# EAGLE design SARduino_644 (EAGLE 5.10)
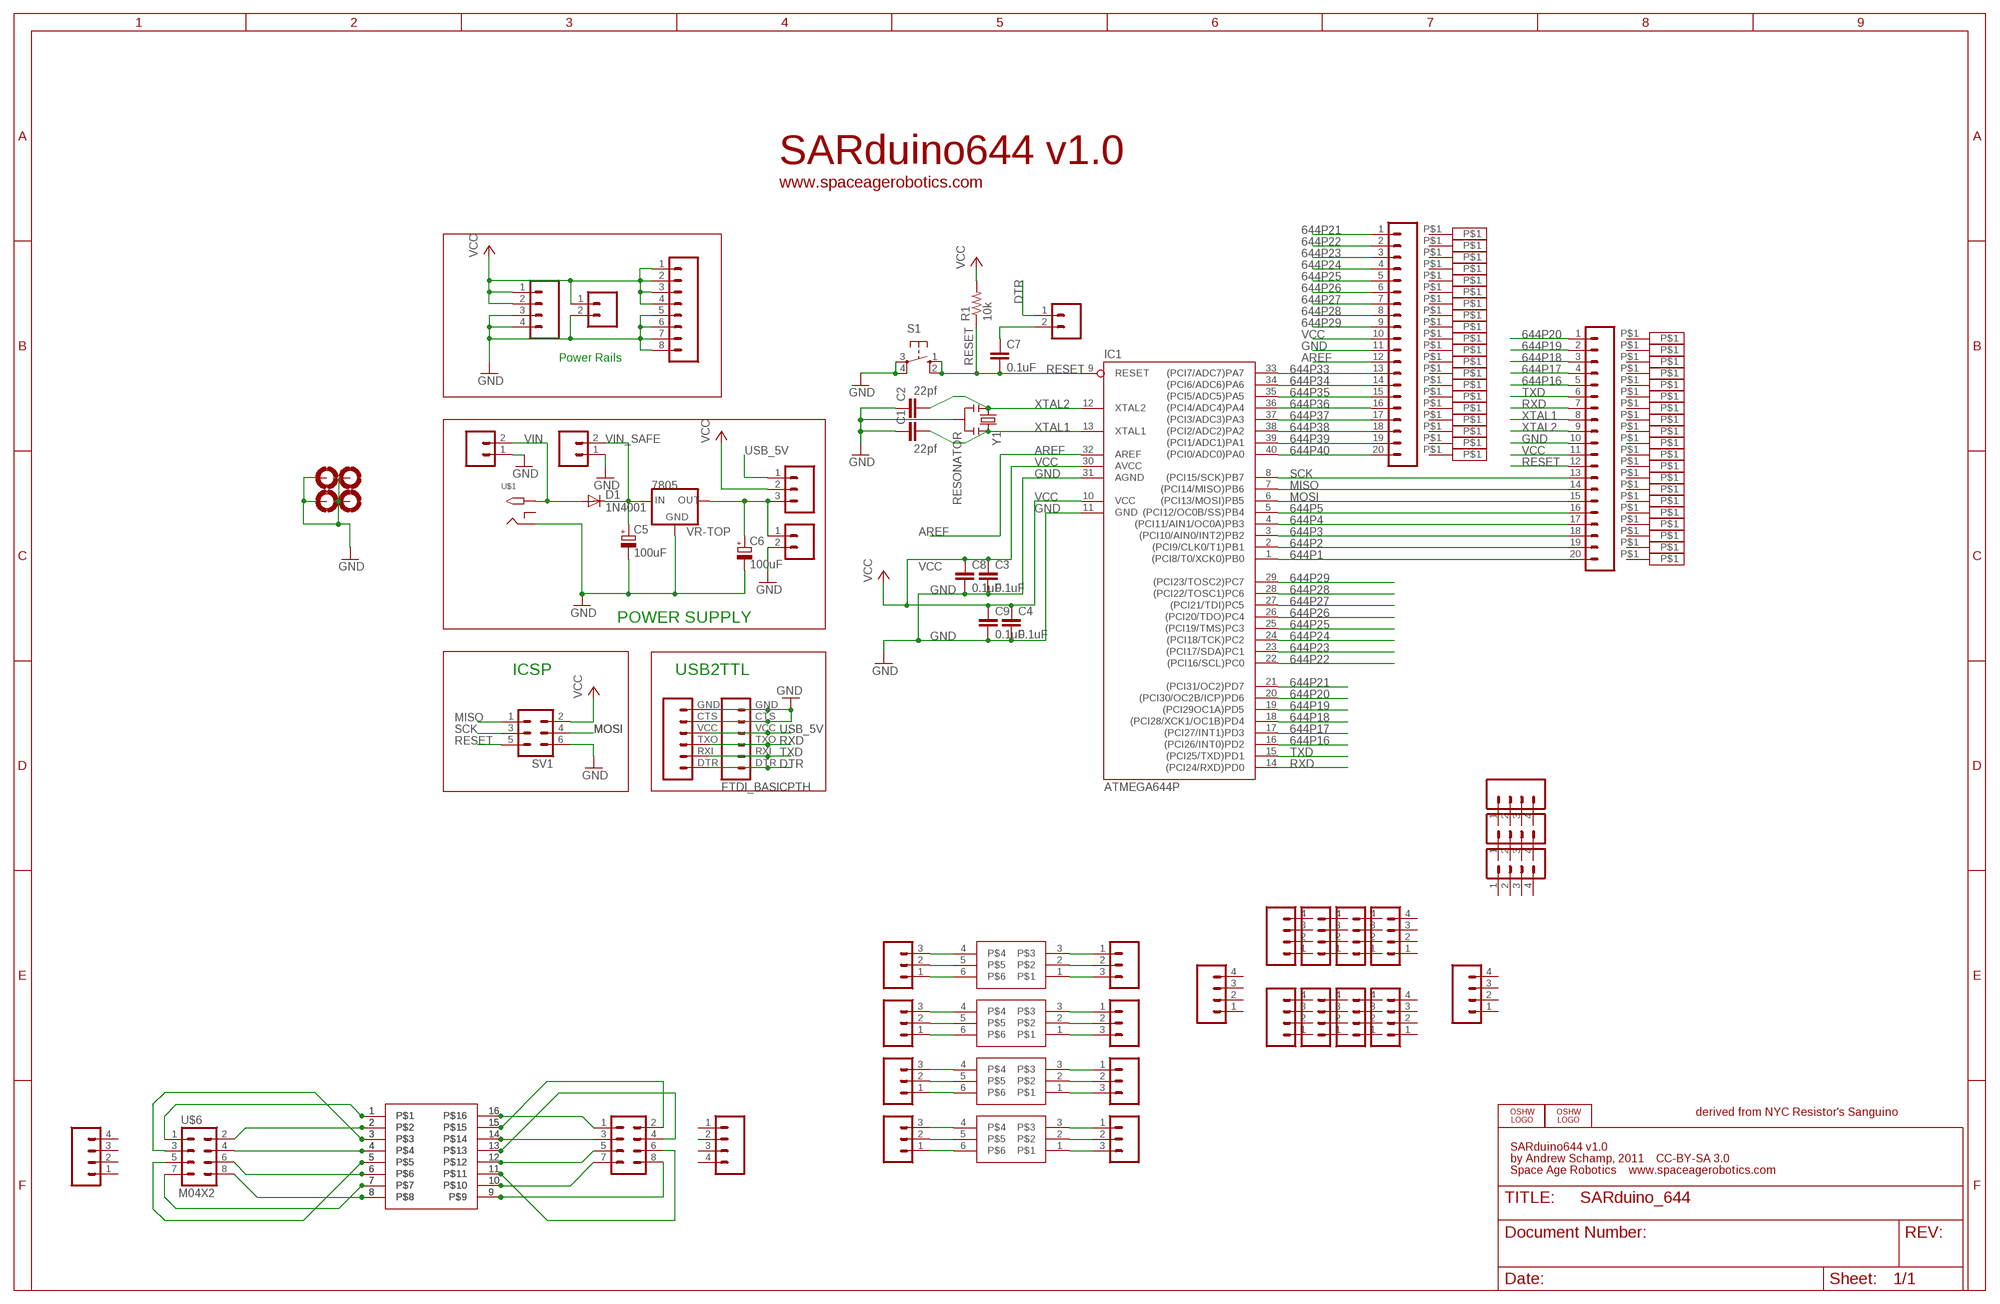
[diagram p0: schematic, sheet 1]

## Parts
C1  22pf  C-EU025-025X050  [C025-025X050]
C2  22pf  C-EU025-025X050  [C025-025X050]
C3  0.1uF  CAPPTH2  [CAP-PTH-SMALL2]
C4  0.1uF  CAPPTH2  [CAP-PTH-SMALL2]
C5  100uF  CPOL-EUE2.5-6  [E2,5-6]
C6  100uF  CPOL-EUE2.5-6  [E2,5-6]
C7  0.1uF  CAPPTH2  [CAP-PTH-SMALL2]
C8  0.1uF  CAP0805  [0805]
C9  0.1uF  CAP0805  [0805]
D1  1N4001  1N4004  [DO41-10]
IC1  ATMEGA644P  ATMEGA644V-10P  [DIL40]
JP1  M03PTH  [1X03]
JP2  M03PTH  [1X03]
JP3  MOUNT-PAD-ROUND2.8  [2,8-PAD]
JP4  MOUNT-PAD-ROUND2.8  [2,8-PAD]
JP5  M03PTH  [1X03]
JP6  M03PTH  [1X03]
JP7  MOUNT-PAD-ROUND2.8  [2,8-PAD]
JP8  M03PTH  [1X03]
JP9  MOUNT-PAD-ROUND2.8  [2,8-PAD]
JP10  FTDI_BASICPTH  [FTDI_BASIC_NO_LABEL]
JP11  M03PTH  [1X03]
JP12  M03PTH  [1X03]
JP13  M03PTH  [1X03]
JP14  M04PTH  [1X04]
JP15  M04PTH  [1X04]
JP16  M04PTH  [1X04]
JP17  M04PTH  [1X04]
JP18  M04PTH  [1X04]
JP19  M04PTH  [1X04]
JP20  M04PTH  [1X04]
JP21  M04PTH  [1X04]
JP22  M04PTH  [1X04]
JP23  M04PTH  [1X04]
JP24  M03PTH  [1X03]
JP25  FTDI_BASICPTH  [FTDI_BASIC_NO_LABEL]
JP26  M04PTH  [1X04]
JP27  M04PTH  [1X04]
JP28  M02PTH  [1X02]
JP29  M20  [1X20]
JP30  M20  [1X20]
JP31  M02PTH  [1X02]
JP32  M02PTH  [1X02]
JP33  M02PTH  [1X02]
JP34  M08  [1X08]
JP35  M04PTH  [1X04]
JP36  M02PTH  [1X02]
JP37  M04PTH  [1X04]
JP38  M04PTH  [1X04]
JP39  M04PTH  [1X04]
LOGO1  OSHW_LOGO_FILLX0350-NT  [OSHW_FILLX350_NOTEXT]
LOGO2  OSHW_LOGO_FILLX0350-NT  [OSHW_FILLX350_NOTEXT]
R1  10k  R-US_0207/2V  [0207/2V]
S1  10-XX  [B3F-10XX]
SV1  ML6  [ML6]
U$1  2.1MMJACKTHM  [PJ-102A]
U$2  3-PIN-STRIP  [1X03_STRIP]
U$3  16-PINSOICW  [SO16W]
U$4  16-PINSOIC  [SO16]
U$5  M04X2  [2X4]
U$6  M04X2  [2X4]
U$8  6-PINSC70-6  [SC70-6L]
U$9  3-PIN-STRIP  [1X03_STRIP]
U$10  3-PIN-STRIP  [1X03_STRIP]
U$11  3-PIN-STRIP  [1X03_STRIP]
U$12  3-PIN-STRIP  [1X03_STRIP]
U$13  3-PIN-STRIP  [1X03_STRIP]
U$14  3-PIN-STRIP  [1X03_STRIP]
U$15  3-PIN-STRIP  [1X03_STRIP]
U$16  3-PIN-STRIP  [1X03_STRIP]
U$17  3-PIN-STRIP  [1X03_STRIP]
U$18  3-PIN-STRIP  [1X03_STRIP]
U$19  3-PIN-STRIP  [1X03_STRIP]
U$20  3-PIN-STRIP  [1X03_STRIP]
U$21  3-PIN-STRIP  [1X03_STRIP]
U$22  3-PIN-STRIP  [1X03_STRIP]
U$23  3-PIN-STRIP  [1X03_STRIP]
U$24  3-PIN-STRIP  [1X03_STRIP]
U$25  3-PIN-STRIP  [1X03_STRIP]
U$26  3-PIN-STRIP  [1X03_STRIP]
U$27  3-PIN-STRIP  [1X03_STRIP]
U$28  3-PIN-STRIP  [1X03_STRIP]
U$29  3-PIN-STRIP  [1X03_STRIP]
U$30  3-PIN-STRIP  [1X03_STRIP]
U$31  3-PIN-STRIP  [1X03_STRIP]
U$32  3-PIN-STRIP  [1X03_STRIP]
U$33  3-PIN-STRIP  [1X03_STRIP]
U$34  3-PIN-STRIP  [1X03_STRIP]
U$35  3-PIN-STRIP  [1X03_STRIP]
U$36  3-PIN-STRIP  [1X03_STRIP]
U$37  3-PIN-STRIP  [1X03_STRIP]
U$38  3-PIN-STRIP  [1X03_STRIP]
U$39  3-PIN-STRIP  [1X03_STRIP]
U$40  3-PIN-STRIP  [1X03_STRIP]
U$41  3-PIN-STRIP  [1X03_STRIP]
U$42  3-PIN-STRIP  [1X03_STRIP]
U$43  3-PIN-STRIP  [1X03_STRIP]
U$44  3-PIN-STRIP  [1X03_STRIP]
U$45  3-PIN-STRIP  [1X03_STRIP]
U$46  3-PIN-STRIP  [1X03_STRIP]
U$47  3-PIN-STRIP  [1X03_STRIP]
U$48  6-PINSOT23-6  [SOT23-6L]
U$50  6-PINSC70-6  [SC70-6L]
U$53  6-PINSOT23-6  [SOT23-6L]
VR-TOP  7805  V_REG_78XXSINK  [TO220-IGO]
Y1  RESONATOR  [RESONATOR/CRYSTAL_COMBO]

## Nets
644P1: IC1.1((PCI8/T0/XCK0)PB0) JP30.20
644P2: IC1.2((PCI9/CLK0/T1)PB1) JP30.19
644P3: IC1.3((PCI10/AIN0/INT2)PB2) JP30.18
644P4: IC1.4((PCI11/AIN1/OC0A)PB3) JP30.17
644P5: IC1.5((PCI12/OC0B/SS)PB4) JP30.16
644P16: IC1.16((PCI26/INT0)PD2) JP30.5
644P17: IC1.17((PCI27/INT1)PD3) JP30.4
644P18: IC1.18((PCI28/XCK1/OC1B)PD4) JP30.3
644P19: IC1.19((PCI29OC1A)PD5) JP30.2
644P20: IC1.20((PCI30/OC2B/ICP)PD6) JP30.1
644P21: IC1.21((PCI31/OC2)PD7) JP29.1
644P22: IC1.22((PCI16/SCL)PC0) JP29.2
644P23: IC1.23((PCI17/SDA)PC1) JP29.3
644P24: IC1.24((PCI18/TCK)PC2) JP29.4
644P25: IC1.25((PCI19/TMS)PC3) JP29.5
644P26: IC1.26((PCI20/TDO)PC4) JP29.6
644P27: IC1.27((PCI21/TDI)PC5) JP29.7
644P28: IC1.28((PCI22/TOSC1)PC6) JP29.8
644P29: IC1.29((PCI23/TOSC2)PC7) JP29.9
644P33: IC1.33((PCI7/ADC7)PA7) JP29.13
644P34: IC1.34((PCI6/ADC6)PA6) JP29.14
644P35: IC1.35((PCI5/ADC5)PA5) JP29.15
644P36: IC1.36((PCI4/ADC4)PA4) JP29.16
644P37: IC1.37((PCI3/ADC3)PA3) JP29.17
644P38: IC1.38((PCI2/ADC2)PA2) JP29.18
644P39: IC1.39((PCI1/ADC1)PA1) JP29.19
644P40: IC1.40((PCI0/ADC0)PA0) JP29.20
AREF: IC1.32(AREF) JP29.12
DTR: JP10.DTR JP25.DTR JP28.1
GND: C1.1 C2.1 C3.2 C4.2 C5.- C6.- C8.2 C9.2 IC1.11(GND) IC1.31(AGND) JP3.B2,8(MOUNT) JP4.B2,8(MOUNT) JP7.B2,8(MOUNT) JP9.B2,8(MOUNT) JP10.CTS JP10.GND JP25.CTS JP25.GND JP29.11 JP30.10 JP31.1 JP32.1 JP33.2 JP34.5 JP34.6 JP34.7 JP34.8 JP35.3 JP35.4 JP36.2 S1.3(P) S1.4(P1) SV1.6 U$1.RING VR-TOP.GND Y1.2
MISO: IC1.7((PCI14/MISO)PB6) JP30.14 SV1.1
MOSI: IC1.6((PCI13/MOSI)PB5) JP30.15 SV1.4
N$1: JP1.3 U$8.4
N$2: JP1.2 U$8.5
N$3: JP1.1 U$8.6
N$4: JP2.3 U$48.4
N$5: JP2.2 U$48.5
N$6: JP2.1 U$48.6
N$7: JP5.1 U$48.3
N$8: JP5.2 U$48.2
N$9: JP5.3 U$48.1
N$10: JP8.1 U$8.3
N$11: U$3.16 U$4.16 U$5.1
N$12: U$3.15 U$4.15 U$5.2
N$13: JP8.2 U$8.2
N$14: U$3.5 U$4.5 U$6.5
N$15: U$3.1 U$4.1 U$6.1
N$16: JP8.3 U$8.1
N$17: JP11.3 U$50.4
N$18: JP11.2 U$50.5
N$19: JP11.1 U$50.6
N$20: JP12.1 U$50.3
N$21: U$3.14 U$4.14 U$5.3
N$22: U$3.13 U$4.13 U$5.4
N$23: U$3.12 U$4.12 U$5.5
N$24: U$3.11 U$4.11 U$5.6
N$25: U$3.10 U$4.10 U$5.7
N$26: U$3.9 U$4.9 U$5.8
N$27: U$3.8 U$4.8 U$6.8
N$28: U$3.7 U$4.7 U$6.7
N$29: U$3.6 U$4.6 U$6.6
N$30: JP12.2 U$50.2
N$31: U$3.4 U$4.4 U$6.4
N$33: U$3.2 U$4.2 U$6.2
N$34: JP12.3 U$50.1
N$35: JP13.3 U$53.4
N$36: JP13.2 U$53.5
N$37: JP13.1 U$53.6
N$38: JP24.1 U$53.3
N$39: JP24.2 U$53.2
N$40: JP24.3 U$53.1
N$41: C7.1 JP28.2
N$42: U$3.3 U$4.3 U$6.3
RESET: C7.2 IC1.9(RESET) JP30.12 R1.1 S1.1(S) S1.2(S1) SV1.5
RXD: IC1.14((PCI24/RXD)PD0) JP10.TXO JP25.TXO JP30.7
SCK: IC1.8((PCI15/SCK)PB7) JP30.13 SV1.3
TXD: IC1.15((PCI25/TXD)PD1) JP10.RXI JP25.RXI JP30.6
USB_5V: JP6.1 JP10.VCC JP25.VCC
VCC [power]: C3.1 C4.1 C8.1 C9.1 IC1.10(VCC) IC1.30(AVCC) JP6.2 JP29.10 JP30.11 JP34.1 JP34.2 JP34.3 JP34.4 JP35.1 JP35.2 JP36.1 R1.2 SV1.2
VIN [power]: D1.A JP32.2 U$1.TIP
VIN_SAFE [power]: C5.+ D1.C JP31.2 VR-TOP.IN
VREG-OUT: C6.+ JP6.3 JP33.1 VR-TOP.OUT
XTAL1: C1.2 IC1.13(XTAL1) JP30.8 Y1.3
XTAL2: C2.2 IC1.12(XTAL2) JP30.9 Y1.1
Unconnected: JP14.1 JP14.2 JP14.3 JP14.4 JP15.1 JP15.2 JP15.3 JP15.4 JP16.1 JP16.2 JP16.3 JP16.4 JP17.1 JP17.2 JP17.3 JP17.4 JP18.1 JP18.2 JP18.3 JP18.4 JP19.1 JP19.2 JP19.3 JP19.4 JP20.1 JP20.2 JP20.3 JP20.4 JP21.1 JP21.2 JP21.3 JP21.4 JP22.1 JP22.2 JP22.3 JP22.4 JP23.1 JP23.2 JP23.3 JP23.4 JP26.1 JP26.2 JP26.3 JP26.4 JP27.1 JP27.2 JP27.3 JP27.4 JP37.1 JP37.2 JP37.3 JP37.4 JP38.1 JP38.2 JP38.3 JP38.4 JP39.1 JP39.2 JP39.3 JP39.4 U$1.RING_SW U$2.P$1 U$9.P$1 U$10.P$1 U$11.P$1 U$12.P$1 U$13.P$1 U$14.P$1 U$15.P$1 U$16.P$1 U$17.P$1 U$18.P$1 U$19.P$1 U$20.P$1 U$21.P$1 U$22.P$1 U$23.P$1 U$24.P$1 U$25.P$1 U$26.P$1 U$27.P$1 U$28.P$1 U$29.P$1 U$30.P$1 U$31.P$1 U$32.P$1 U$33.P$1 U$34.P$1 U$35.P$1 U$36.P$1 U$37.P$1 U$38.P$1 U$39.P$1 U$40.P$1 U$41.P$1 U$42.P$1 U$43.P$1 U$44.P$1 U$45.P$1 U$46.P$1 U$47.P$1

## Notes on the sheet
- SARduino644 v1.0
- www.spaceagerobotics.com
- Power Rails
- POWER SUPPLY
- ICSP | USB2TTL
- derived from NYC Resistor's Sanguino
- SARduino644 v1.0
- by Andrew Schamp, 2011    CC-BY-SA 3.0
- Space Age Robotics    www.spaceagerobotics.com

## Library data of the parts
C1 C2 = rcl:C-EU: CAPACITOR, European symbol
C3 C4 C7-C9 = ideabot:CAP: Capacitor Standard 0603 ceramic capacitor, and 0.1" leaded capacitor.
C5 C6 = rcl:CPOL-EU: POLARIZED CAPACITOR, European symbol
D1 = diode:1N4004: DIODE general purpose rectifier, 1 A
IC1 = avr:ATMEGA644*P: MICROCONTROLLER 64 kBytes FLASH 4 kBytes SRAM 2 kBytes EEPROM DUAL USART 8-channel 10 bit ADC
JP1 JP2 JP5 JP6 JP8 JP11-JP13 JP24 = SparkFun:M03: Header 3 Standard 3-pin 0.1" header. Use with straight break away headers (SKU : PRT-00116), right angle break away headers (PRT-00553), swiss pins (PRT-00743), machine pins (PRT-00117), and female headers (PRT-00115). Molex polarized connector foot print use with SKU : PRT-08232 with associated crimp pins and housings.
JP3 JP4 JP7 JP9 = holes:MOUNT-PAD-ROUND: MOUNTING PAD, round
JP10 JP25 = SparkFun:FTDI_BASIC: FTDI Basic: 3.3V and 5V
JP14-JP23 JP26 JP27 JP35 JP37-JP39 = SparkFun:M04: Header 4 Standard 4-pin 0.1" header. Use with straight break away headers (SKU : PRT-00116), right angle break away headers (PRT-00553), swiss pins (PRT-00743), machine pins (PRT-00117), and female headers (PRT-00115). Molex polarized connector foot print use with SKU : PRT-08231 with associated crimp pins and housings. 1MM SMD Version SKU: PRT-10208
JP28 JP31-JP33 JP36 = SparkFun:M02: Header 2 Standard 2-pin 0.1" header. Use with straight break away headers (SKU : PRT-00116), right angle break away headers (PRT-00553), swiss pins (PRT-00743), machine pins (PRT-00117), and female headers (PRT-00115). Molex polarized connector foot print use with SKU : PRT-08233 with associated crimp pins and housings.
JP29 JP30 = SparkFun:M20: This is just like the LOCK variant in that the holes are staggared by 5 mil, but except for the last two holes. They are not altered from the "standard" footprint layout. This is used for a special purpose on the layout of our Graphic LCD Backpack. Make sure you want to use this device before selecting it for you project!
JP34 = SparkFun:M08: Header 8 Standard 8-pin 0.1" header. Use with straight break away headers (SKU : PRT-00116), right angle break away headers (PRT-00553), swiss pins (PRT-00743), machine pins (PRT-00117), and female headers (PRT-00115).
LOGO1 LOGO2 = OSHW:OSHW_LOGO_FILL
R1 = adafruit:R-US_: RESISTOR, American symbol
S1 = switch-omron:10-XX: OMRON SWITCH
SV1 = con-harting-ml:ML6: HARTING
U$1 = adafruit:2.1MMJACK: 2.1mm x 5.5mm THM DC jack with internal switch. Digikey part #PJ-102A, 4UCON part #05537 2.1mm x 5.5mm SMT DC jack with internal switch. Digikey part #PJ-002A-SMT, 4UCON part #03267 By microbuilder.eu & adafruit.com
U$2 U$9-U$47 = ideabot:3-PIN-STRIP
U$3 U$4 = ideabot:16-PIN
U$5 U$6 = SparkFun:M04X2
U$8 U$48 U$50 U$53 = ideabot:6-PIN
VR-TOP = SparkFun:V_REG_78XX: Voltage Regulator Standard 7805 5V regulator. IGO (Input Ground Output). Spark Fun Electronics SKU : COM-00107
Y1 = ideabot:RESONATOR: Resonator Small SMD resonator. This is the itty bitty 10/20MHz resonators with built in caps. CSTCE10M0G55 and CSTCE20M0V53. Footprint has been reviewed closely but hasn't been tested yet.

## Net classes
0 default: width 0.254 mm, clearance 0.152 mm
1 power: width 0.305 mm, clearance 0.152 mm

## Board
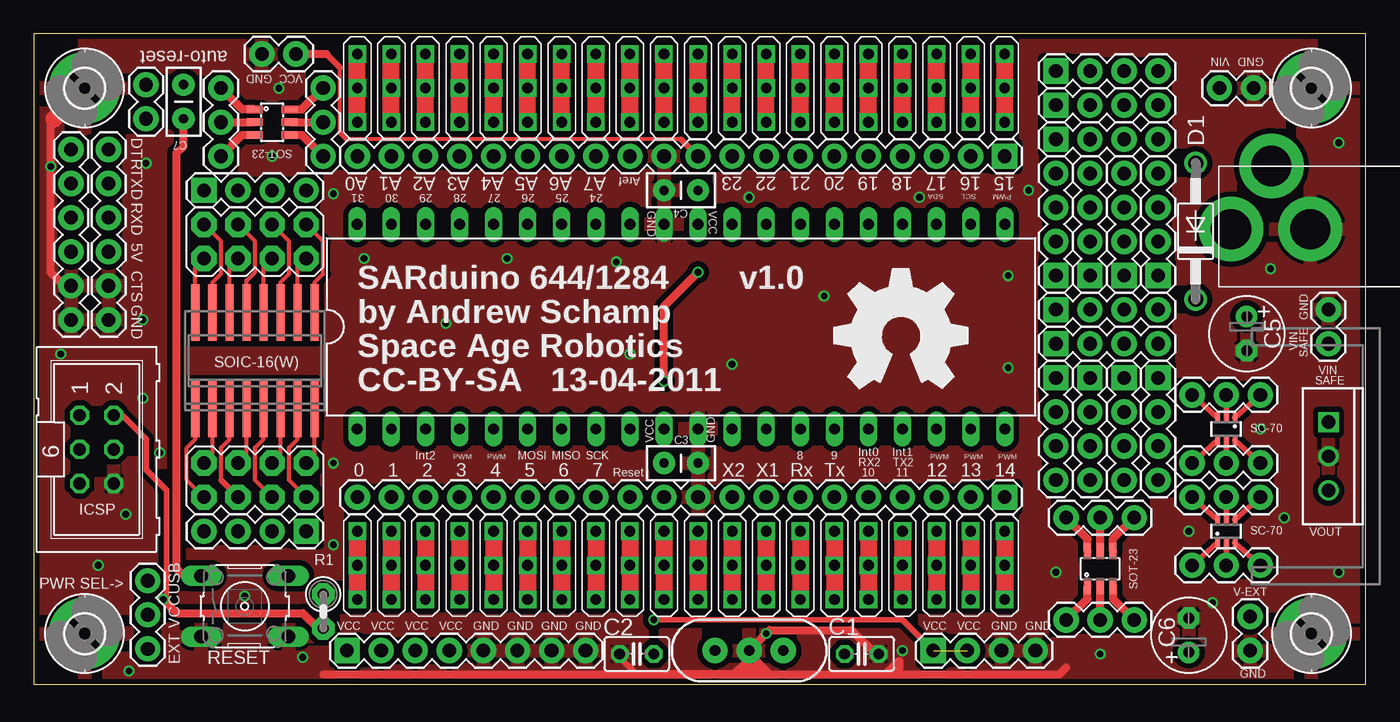
[diagram p1: board, top side]
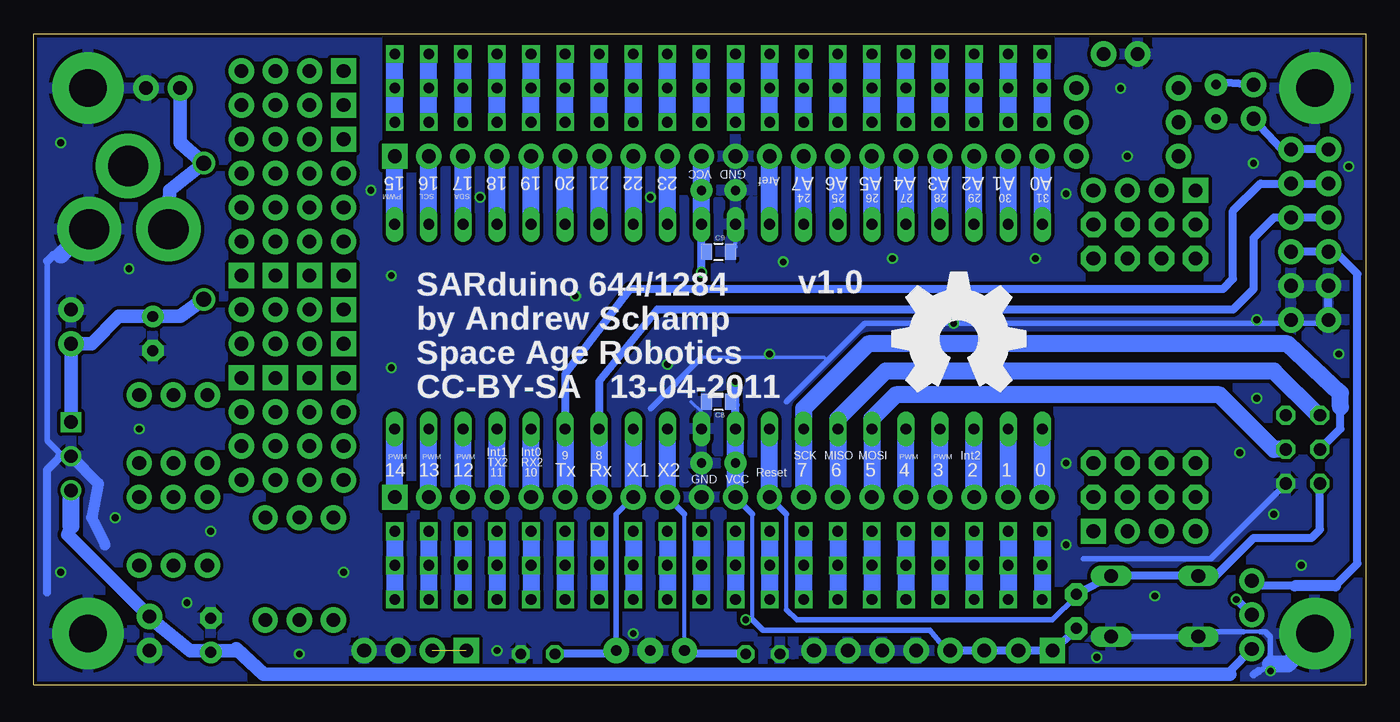
[diagram p2: board, bottom side, seen from below]

Size 99.31 x 48.51 mm. Coordinates in mm from the lower left corner, seen from the top.
Outline: 99.31,0 99.31,48.51 0,48.51 0,0 99.31,0
Copper layers (1*16): Top 0.035mm / dielectric 1.5mm / Bottom 0.035mm
Design rules: minimum track width 6mil, minimum drill 12mil, track to track 6mil, track to pad 6mil, pad to pad 6mil, via to via 6mil, smd to smd 0mil, copper to edge 10mil, drill to drill 10mil, minimum pad ring 10mil, minimum via ring 6mil, stop-mask expansion 2mil, vias tented up to drill 100mil, thermal gap 10mil

### Footprints (pad centres in the part's own frame; a part is rotated, then mirrored left to right if it is on the bottom)
C025-025X050 = drill 0.813 octagon: 1 -1.27,0; 2 1.27,0
CAP-PTH-SMALL2 = drill 0.7 pad 1.651: 1 0,0; 2 2.54,0
E2,5-6 = drill 0.813 pad 1.6: + -1.27,0 | drill 0.813 pad 1.6 octagon: - 1.27,0
0805 = smd 0.8 x 1.2: 1 -0.9,0; 2 0.9,0
DO41-10 = drill 1.118: A 5.08,0; C -5.08,0
DIL40 = drill 0.813 long: 1 -24.13,-7.62; 2 -21.59,-7.62; 3 -19.05,-7.62; 4 -16.51,-7.62; 5 -13.97,-7.62; 6 -11.43,-7.62; 7 -8.89,-7.62; 8 -6.35,-7.62; 9 -3.81,-7.62; 10 -1.27,-7.62; 11 1.27,-7.62; 12 3.81,-7.62; 13 6.35,-7.62; 14 8.89,-7.62; 15 11.43,-7.62; 16 13.97,-7.62; 17 16.51,-7.62; 18 19.05,-7.62; 19 21.59,-7.62; 20 24.13,-7.62; 21 24.13,7.62; 22 21.59,7.62; 23 19.05,7.62; 24 16.51,7.62; 25 13.97,7.62; 26 11.43,7.62; 27 8.89,7.62; 28 6.35,7.62; 29 3.81,7.62; 30 1.27,7.62; 31 -1.27,7.62; 32 -3.81,7.62; 33 -6.35,7.62; 34 -8.89,7.62; 35 -11.43,7.62; 36 -13.97,7.62; 37 -16.51,7.62; 38 -19.05,7.62; 39 -21.59,7.62; 40 -24.13,7.62
1X03 = drill 1.016 pad 1.88: 1 0,0; 2 2.54,0; 3 5.08,0
2,8-PAD = drill 2.8 pad 5.334: B2,8 0,0
FTDI_BASIC_NO_LABEL = drill 1.016 pad 1.88: CTS 10.16,0; DTR 0,0; GND 12.7,0; RXI 2.54,0; TXO 5.08,0; VCC 7.62,0
1X04 = drill 1.016 pad 1.88 square: 1 0,0 | drill 1.016 pad 1.88: 2 2.54,0; 3 5.08,0; 4 7.62,0
1X02 = drill 1.016 pad 1.88: 1 0,0; 2 2.54,0
1X20 = drill 1.016 pad 1.88 square: 1 0,0 | drill 1.016 pad 1.88: 2 2.54,0; 3 5.08,0; 4 7.62,0; 5 10.16,0; 6 12.7,0; 7 15.24,0; 8 17.78,0; 9 20.32,0; 10 22.86,0; 11 25.4,0; 12 27.94,0; 13 30.48,0; 14 33.02,0; 15 35.56,0; 16 38.1,0; 17 40.64,0; 18 43.18,0; 19 45.72,0; 20 48.26,0
1X08 = drill 1.016 pad 1.88 square: 1 0,0 | drill 1.016 pad 1.88: 2 2.54,0; 3 5.08,0; 4 7.62,0; 5 10.16,0; 6 12.7,0; 7 15.24,0; 8 17.78,0
0207/2V = drill 0.813 pad 1.676 octagon: 1 -1.27,0; 2 1.27,0
B3F-10XX = drill 1.016 long: 1 -3.251,2.261; 2 3.251,2.261; 3 -3.251,-2.261; 4 3.251,-2.261
ML6 = drill 0.914 octagon: 1 -2.54,-1.27; 2 -2.54,1.27; 3 0,-1.27; 4 0,1.27; 5 2.54,-1.27; 6 2.54,1.27
PJ-102A = drill 3 pad 4.8: RING 0.1,-3.39; RING_SW -4.6,-6.29; TIP 0.1,-9.29
1X03_STRIP = drill 0.8 square: P$1 0,0; P$2 -2.54,0; P$3 2.54,0
SO16W = smd 0.6 x 2.2: 1 -4.445,-4.6; 2 -3.175,-4.6; 3 -1.905,-4.6; 4 -0.635,-4.6; 5 0.635,-4.6; 6 1.905,-4.6; 7 3.175,-4.6; 8 4.445,-4.6; 9 4.445,4.6; 10 3.175,4.6; 11 1.905,4.6; 12 0.635,4.6; 13 -0.635,4.6; 14 -1.905,4.6; 15 -3.175,4.6; 16 -4.445,4.6
SO16 = smd 0.6 x 2.2: 1 -4.445,-2.6; 2 -3.175,-2.6; 3 -1.905,-2.6; 4 -0.635,-2.6; 5 0.635,-2.6; 6 1.905,-2.6; 7 3.175,-2.6; 8 4.445,-2.6; 9 4.445,2.6; 10 3.175,2.6; 11 1.905,2.6; 12 0.635,2.6; 13 -0.635,2.6; 14 -1.905,2.6; 15 -3.175,2.6; 16 -4.445,2.6
2X4 = drill 1.016 pad 1.88 octagon: 1 -3.81,-1.27; 2 -3.81,1.27; 3 -1.27,-1.27; 4 -1.27,1.27; 5 1.27,-1.27; 6 1.27,1.27; 7 3.81,-1.27; 8 3.81,1.27
SC70-6L = smd 0.35 x 0.8: 1 -0.65,-0.85; 2 0,-0.85; 3 0.65,-0.85; 4 0.65,0.85; 5 0,0.85; 6 -0.65,0.85
SOT23-6L = smd 0.55 x 1.2: 1 -0.95,-1.3; 2 0,-1.3; 3 0.95,-1.3; 4 0.95,1.3; 5 0,1.3; 6 -0.95,1.3
TO220-IGO = drill 1: GND 0,0; OUT 2.54,0 | drill 1 square: IN -2.54,0
RESONATOR/CRYSTAL_COMBO = drill 0.8 pad 1.88: 1 -2.54,0; 2 0,0; 3 2.54,0

### Placement (x,y rotation side)
C1  61.72,2.29 180 top
C2  44.96,2.29 0 top
C3  46.99,16.51 0 top
C4  49.53,36.83 180 top
C5  90.42,26.16 270 top
C6  86.11,3.68 90 top
C7  11.18,44.7 270 top
C8  48.26,21.08 180 bottom
C9  48.26,32.26 0 bottom
D1  86.61,33.78 90 top
IC1  48.26,26.67 0 top
JP1  86.36,13.97 0 top
JP2  21.59,44.45 270 top
JP3  3.81,3.81 0 top
JP4  95.25,3.81 0 top
JP5  13.97,39.37 90 top
JP6  8.51,7.75 270 top
JP7  3.81,44.45 0 top
JP8  91.44,8.89 180 top
JP9  95.25,44.45 0 top
JP10  2.79,39.88 270 top
JP11  91.44,16.51 180 top
JP12  86.36,21.59 0 top
JP13  76.96,12.45 0 top
JP14  76.2,30.48 90 top
JP15  78.74,30.48 90 top
JP16  81.28,30.48 90 top
JP17  83.82,30.48 90 top
JP18  76.2,22.86 270 top
JP19  78.74,22.86 270 top
JP20  81.28,22.86 270 top
JP21  83.82,22.86 270 top
JP22  12.7,36.83 0 top
JP23  20.32,11.43 180 top
JP24  82.04,4.83 180 top
JP25  5.59,39.88 270 top
JP26  76.2,27.94 0 top
JP27  76.2,25.4 0 top
JP28  8.38,42.16 90 top
JP29  72.39,39.37 180 top
JP30  72.39,13.97 180 top
JP31  96.52,27.94 270 top
JP32  90.93,44.45 180 top
JP33  90.68,5.08 270 top
JP34  23.37,2.54 0 top
JP35  67.06,2.54 0 top
JP36  19.56,46.99 180 top
JP37  76.2,40.64 0 top
JP38  76.2,43.18 0 top
JP39  76.2,45.72 0 top
LOGO1  59.69,22.1 0 top
LOGO2  35.31,21.84 0 bottom
R1  21.59,5.46 270 top
S1  15.75,5.84 0 top
SV1  4.7,17.53 270 top
U$1  98.55,34.04 270 top
U$2  24.13,44.45 90 top
U$3  16.51,24.13 0 top
U$4  16.51,24.13 0 top
U$5  16.51,33.02 0 top
U$6  16.51,15.24 0 top
U$8  88.9,11.43 0 top
U$9  26.67,44.45 90 top
U$10  31.75,44.45 90 top
U$11  29.21,44.45 90 top
U$12  34.29,44.45 90 top
U$13  36.83,44.45 90 top
U$14  39.37,44.45 90 top
U$15  41.91,44.45 90 top
U$16  44.45,44.45 90 top
U$17  46.99,44.45 90 top
U$18  49.53,44.45 90 top
U$19  52.07,44.45 90 top
U$20  54.61,44.45 90 top
U$21  57.15,44.45 90 top
U$22  59.69,44.45 90 top
U$23  62.23,44.45 90 top
U$24  72.39,8.89 270 top
U$25  64.77,44.45 90 top
U$26  67.31,44.45 90 top
U$27  69.85,44.45 90 top
U$28  72.39,44.45 90 top
U$29  69.85,8.89 270 top
U$30  67.31,8.89 270 top
U$31  64.77,8.89 270 top
U$32  62.23,8.89 270 top
U$33  59.69,8.89 270 top
U$34  57.15,8.89 270 top
U$35  54.61,8.89 270 top
U$36  52.07,8.89 270 top
U$37  49.53,8.89 270 top
U$38  46.99,8.89 270 top
U$39  44.45,8.89 270 top
U$40  41.91,8.89 270 top
U$41  39.37,8.89 270 top
U$42  36.83,8.89 270 top
U$43  34.29,8.89 270 top
U$44  31.75,8.89 270 top
U$45  29.21,8.89 270 top
U$46  26.67,8.89 270 top
U$47  24.13,8.89 270 top
U$48  17.78,41.91 270 top
U$50  88.9,19.05 180 top
U$53  79.5,8.64 0 top
VR-TOP  96.52,17.02 270 top
Y1  53.34,2.54 0 top

### Tracks (layer width: path | path; a pad name or v marks a point on that pad's centre or on a via)
644P1
  Bottom 1.27: JP30.20 IC1.1
644P2
  Bottom 1.27: JP30.19 IC1.2
644P3
  Bottom 1.27: JP30.18 IC1.3
644P4
  Bottom 1.27: JP30.17 IC1.4
644P5
  Bottom 1.27: JP30.16 IC1.5
644P16
  Bottom 1.27: JP30.5 IC1.16
644P17
  Bottom 1.27: JP30.4 IC1.17
644P18
  Bottom 1.27: JP30.3 IC1.18
644P19
  Bottom 1.27: JP30.2 IC1.19
644P20
  Bottom 1.27: JP30.1 IC1.20
644P21
  Bottom 1.27: IC1.21 JP29.1
644P22
  Bottom 1.27: IC1.22 JP29.2
644P23
  Bottom 1.27: IC1.23 JP29.3
644P24
  Bottom 1.27: IC1.24 JP29.4
644P25
  Bottom 1.27: IC1.25 JP29.5
644P26
  Bottom 1.27: IC1.26 JP29.6
644P27
  Bottom 1.27: IC1.27 JP29.7
644P28
  Bottom 1.27: IC1.28 JP29.8
644P29
  Bottom 1.27: IC1.29 JP29.9
644P33
  Bottom 1.27: IC1.33 JP29.13
644P34
  Bottom 1.27: IC1.34 JP29.14
644P35
  Bottom 1.27: IC1.35 JP29.15
644P36
  Bottom 1.27: IC1.36 JP29.16
644P37
  Bottom 1.27: IC1.37 JP29.17
644P38
  Bottom 1.27: IC1.38 JP29.18
644P39
  Bottom 1.27: IC1.39 JP29.19
644P40
  Bottom 1.27: IC1.40 JP29.20
AREF
  Bottom 1.27: IC1.32 JP29.12
DTR
  Bottom 0.61: JP10.DTR JP25.DTR 6.27,39.88 JP28.1
GND  (via drill 0.51)
  Top 0.406: 53.09,2.03 53.34,2.29 Y1.2 | 53.09,1.78 52.07,0.76 44.96,0.76 43.69,2.03 C2.1
  Top 0.61: 1.52,42.16 1.27,41.91 1.27,30.73 2.29,29.72 JP10.CTS | C1.1 62.74,2.29 60.96,4.06 54.86,4.06 v54.61,3.81 Y1.2 | 53.34,2.79 53.34,2.29 54.86,0.76 | 54.86,0.76 63.5,0.76 64.52,1.78 64.52,1.02 64.26,0.76 | 54.36,0.76 44.2,0.76 | 54.86,0.76 54.36,0.76 | 54.36,0.76 53.85,1.27 53.09,1.27 52.83,1.02 | 21.59,0.76 76.45,0.76 76.96,1.27 | 53.09,1.78 53.09,2.03
  Top 1.27: 1.52,42.16 JP7.B2,8
  Bottom 0.254: 49.28,24.38 40.39,24.38 40.13,24.13 | 49.53,20.07 IC1.11 49.53,20.32 50.29,21.08
  Bottom 0.305: 7.87,3.94 9.14,3.94 | C9.2 46.99,32.63 46.99,33.78
  Bottom 0.406: 8,1.02 7.11,1.4 7.11,1.52 7.11,3.56 7.49,3.94 7.87,3.94 | 9.14,3.94 11.63,3.94 S1.3 S1.4 | 97.41,17.02 97.16,17.02 | 97.16,17.02 VR-TOP.GND | 97.16,17.02 98.3,18.16 98.3,31.56 | 2.79,26.92 v30.73,26.92 37.34,26.92 40.13,24.13 43.18,21.08 | 21.08,9.4 11.56,9.4 SV1.6 | 49.53,24.38 53.34,20.57
  Bottom 0.61: 97.28,32 97.86,32 98.3,31.56 | 8,1.02 8.38,0.76 | 2.79,26.92 2.79,29.21 3.05,29.46 | 97.41,17.02 97.41,16.89 98.3,16 98.3,6.86
  Bottom 0.813: 93.98,10.41 95,12.45 94.49,14.99 VR-TOP.GND
  Bottom 1.27: JP3.B2,8 3.81,3.56 5.84,1.52 7.11,1.52 | U$1.RING 95.67,33.62 97.28,32
  other vias: 66.04,36.32 53.34,36.32 97.28,40.39 92.2,30.99 86.11,11.43 93.22,12.45 97.28,8.38 87.88,6.1 74.17,36.83 8.38,38.86 17.78,39.37 22.35,36.58 24.64,31.75 35.31,31.75 2.03,24.64 8.13,27.18 43.43,31.5 8.13,21.34 44.45,24.64 9.4,17.27 22.35,16.51 20.07,2.03 18.29,44.45 76.2,8.38 52.07,23.88 58.93,28.96 72.64,30.48 72.64,23.62 91.44,19.05 22.35,10.41 4.83,8.89 7.11,1.02 15.75,6.6 6.86,12.7 64.77,2.54 79.5,2.29 1.27,38.61
  pour Bottom (isolate 0.254): -0.51,49.02 -0.25,-0.25 99.57,-0.51 99.31,48.77
  pour Top (isolate 0.406): -0.25,48.51 -0.25,0.25 0.25,-0.25 99.57,-0.25 100.08,0.25 100.08,48.77 2.03,49.28
MISO
  Bottom 1.27: SV1.1 3.56,20.07 6.86,23.37 35.81,23.37 39.37,19.81 IC1.7 JP30.14
MOSI
  Bottom 1.27: SV1.4 6.86,17.53 10.92,21.59 35.05,21.59 36.83,19.81 IC1.6 JP30.15
N$1
  Top 0.406: U$8.4 JP1.3
N$2
  Top 0.406: U$8.5 JP1.2
N$3
  Top 0.406: U$8.6 JP1.1
N$4
  Top 0.61: U$48.4 20,40.96 JP2.3
N$5
  Top 0.61: U$48.5 JP2.2
N$6
  Top 0.61: U$48.6 20,42.86 JP2.1
N$7
  Top 0.61: U$48.3 15.56,40.96 JP5.1
N$8
  Top 0.61: JP5.2 U$48.2
N$9
  Top 0.61: U$48.1 15.56,42.86 JP5.3
N$10
  Top 0.406: U$8.3 JP8.1
N$11
  Top 0.305: U$5.1 12.06,31.11 U$3.16
  Top 0.61: U$4.16 U$3.16
N$12
  Top 0.305: U$3.15 13.34,29.97 13.97,30.61 13.97,33.02 U$5.2
  Top 0.61: U$4.15 U$3.15
N$13
  Top 0.406: JP8.2 U$8.2
N$14
  Top 0.305: U$3.5 17.14,18.29 16.51,17.65 16.51,15.24 U$6.5
  Top 0.61: U$3.5 U$4.5
N$15
  Top 0.305: U$3.1 12.06,18.29 11.43,17.65 11.43,15.24 U$6.1
  Top 0.61: U$3.1 U$4.1
N$16
  Top 0.406: JP8.3 U$8.1
N$17
  Top 0.406: JP11.3 U$50.4
N$18
  Top 0.406: JP11.2 U$50.5
N$19
  Top 0.406: U$50.6 JP11.1
N$20
  Top 0.406: U$50.3 JP12.1
N$21
  Top 0.305: U$3.14 14.61,31.11 U$5.3
  Top 0.61: U$4.14 U$3.14
N$22
  Top 0.305: U$5.4 16.51,33.02 16.51,30.73 15.88,30.1 U$3.13
  Top 0.61: U$4.13 U$3.13
N$23
  Top 0.305: U$3.12 17.14,31.11 U$5.5
  Top 0.61: U$4.12 U$3.12
N$24
  Top 0.305: U$5.6 19.05,33.02 19.05,30.61 18.41,29.97 U$3.11
  Top 0.61: U$4.11 U$3.11
N$25
  Top 0.305: U$3.10 19.68,31.11 U$5.7
  Top 0.61: U$4.10 U$3.10
N$26
  Top 0.305: U$5.8 21.59,33.02 21.59,30.61 20.95,29.97 U$3.9
  Top 0.61: U$4.9 U$3.9
N$27
  Top 0.305: U$3.8 20.95,17.14 U$6.8
  Top 0.61: U$3.8 U$4.8
N$28
  Top 0.305: U$3.7 19.68,18.29 19.05,17.65 19.05,15.24 U$6.7
  Top 0.61: U$3.7 U$4.7
N$29
  Top 0.305: U$3.6 18.41,17.14 U$6.6
  Top 0.61: U$3.6 U$4.6
N$30
  Top 0.406: U$50.2 JP12.2
N$31
  Top 0.305: U$3.4 15.88,17.14 U$6.4
  Top 0.61: U$3.4 U$4.4
N$33
  Top 0.305: U$3.2 13.34,17.14 U$6.2
  Top 0.61: U$3.2 U$4.2
N$34
  Top 0.406: U$50.1 JP12.3
N$35
  Top 0.61: U$53.4 80.45,10.86 JP13.3
N$36
  Top 0.61: U$53.5 JP13.2
N$37
  Top 0.61: U$53.6 78.55,10.86 JP13.1
N$38
  Top 0.61: U$53.3 80.45,6.42 JP24.1
N$39
  Top 0.61: JP24.2 U$53.2
N$40
  Top 0.61: U$53.1 78.55,6.42 JP24.3
N$41
  Bottom 0.61: JP28.2 11,44.88 C7.1
N$42
  Top 0.305: 13.97,15.24 13.97,17.65 14.61,18.29 U$3.3
  Top 0.406: U$6.3 13.97,15.24
  Top 0.61: U$3.3 U$4.3
RESET
  Top 0.61: C7.2 11.18,40.13 10.67,39.62 10.67,8.64 11.05,8.26 11.84,8.26 S1.1
  Bottom 0.305: 43.18,5.59 43.18,12.7
  Bottom 0.406: S1.2 18.95,8.1 | 11.2,8.1 S1.1 | 43.18,12.7 JP30.12 | 43.18,5.59 42.42,4.83 23.37,4.83 21.59,6.6 R1.1
  Bottom 0.61: S1.1 S1.2 | 18.95,8.1 R1.1 | 11.2,8.1 8.38,10.92 4.06,10.92 3.43,11.56 SV1.5
  Bottom 1.27: JP30.12 IC1.9
RXD
  Bottom 0.61: IC1.14 57.15,22.61 52.83,27.94 9.91,27.94 8.38,29.46 8.38,33.27 6.86,34.8 JP25.TXO JP10.TXO
  Bottom 1.27: IC1.14 JP30.7
SCK
  Bottom 0.61: 1.91,20.7 1.91,19.05 SV1.3
  Bottom 1.27: 1.91,20.7 1.91,21.72 5.84,25.4 37.08,25.4 41.91,20.57 IC1.8 JP30.13
TXD
  Bottom 0.61: IC1.15 59.69,23.11 54.86,29.46 10.67,29.46 9.91,30.23 9.91,35.31 7.87,37.34 JP25.RXI JP10.RXI
  Bottom 1.27: IC1.15 JP30.6
USB_5V
  Bottom 0.61: 5.33,7.37 8.13,7.37 JP6.1 | 2.29,7.37 0.64,9.02 0.64,30.61 2.29,32.26 JP10.VCC JP25.VCC
  Bottom 0.813: 2.29,7.37 5.33,7.37
VCC  (via drill 0.51)  (1 unrouted)
  Top 0.305: 22.86,41.15 22.86,45.97 | 48.26,40.64 23.37,40.64
  Top 0.406: v9.65,6.35 9.91,6.6 9.91,14.48 8.38,16 8.38,18.29 6.6,20.07 SV1.2 | v46.23,4.83 64.77,4.83 JP35.1 | 22.86,45.97 21.84,46.99 | 23.37,40.64 22.86,41.15 | JP29.10 48.26,40.64
  Top 0.61: v46.99,22.61 46.99,28.19 v49.53,30.73 | R1.2 21.21,4.19 20.07,5.33 10.67,5.33 v9.65,6.35 | 21.84,46.99 JP36.1
  Bottom 0.305: 45.72,4.83 45.72,12.7 | C8.1 47.11,20.83 46.99,20.83 | C9.1 49.41,32.51 49.53,32.51
  Bottom 0.406: 45.72,12.7 JP30.11 | v46.23,4.83 45.72,4.83 44.96,4.06 32.51,4.06 31.24,2.54 JP34.4 | R1.2 21.59,4.06
  Bottom 0.61: IC1.10 46.99,20.83 v46.99,22.61 | v49.53,30.73 49.53,32.51 49.53,34.04 | IC1.30 49.53,35.05 | 8.64,5.33 JP6.2 v9.65,6.35 | JP34.4 JP34.3 JP34.2 JP34.1 21.59,4.06
  Bottom 1.27: 49.53,34.04 IC1.30 | 49.53,35.05 C4.1 JP29.10 | IC1.10 C3.1 JP30.11
VIN
  Bottom 1.016: U$1.TIP 89.26,34.18 89.15,36.83 D1.A 88.39,40.39 JP32.2
VIN_SAFE
  Bottom 1.016: D1.C 88.39,27.43 C5.+ 92.96,27.43 95,25.4 JP31.2 VR-TOP.IN
VREG-OUT
  Bottom 0.61: 10.16,0.76 10.16,1.02 JP6.3
  Bottom 1.016: 10.16,0.76 82.17,0.76 84.2,2.67 84.33,2.54 85.72,2.54 | 96.52,11.81 96.77,11.18 90.3,4.7 | 90.3,4.7 87.63,2.54 85.72,2.54 | JP33.1 90.55,4.7 90.3,4.7 | 85.72,2.54 C6.+
  Bottom 1.27: 96.52,11.81 VR-TOP.OUT
XTAL1
  Bottom 0.406: JP30.8 55.88,12.7 Y1.3
  Bottom 0.61: Y1.3 55.88,2.29 C1.2
  Bottom 1.27: JP30.8 IC1.13
XTAL2
  Bottom 0.305: Y1.1 50.8,12.7
  Bottom 0.406: 50.8,12.7 JP30.9
  Bottom 0.61: C2.2 50.55,2.29 Y1.1
  Bottom 1.27: JP30.9 IC1.12

### Text on the board
tPlace: auto-reset | VIN | GND | GND | VCC | DTR | SOT-23 | TXD | A0 | A1 | A2 | A3 | A4 | A5 | A6 | A7 | Aref | 23 | 22 | 21 | 20 | 19 | 18 | 17 | 16 | 15 | 31 | 30 | 29 | 28 | 27 | 26 | 25 | 24 | SDA | SCL | PWM | RXD | GND | VCC | 5V | CTS | SARduino 644/1284 | v1.0 | GND | by Andrew Schamp | GND | VIN | SOIC-16(W) | Space Age Robotics | SAFE | VIN | CC-BY-SA 13-04-2011 | SAFE | SC-70 | VCC | GND | Int2 | PWM | PWM | MOSI | MISO | SCK | 8 | 9 | Int0 | Int1 | PWM | PWM | PWM | RX2 | TX2 | 11 | 0 | 1 | 2 | 3 | 4 | 5 | 6 | 7 | Reset | X2 | X1 | Rx | Tx | 10 | 12 | 13 | 14 | ICSP | VOUT | SC-70 | PWR SEL-> | USB | SOT-23 | V-EXT | VCC | VCC | VCC | VCC | VCC | GND | GND | GND | GND | VCC | VCC | GND | GND | EXT | RESET | GND
bPlace: A0 | A1 | A2 | A3 | A4 | A5 | A6 | A7 | Aref | GND | VCC | 23 | 22 | 21 | 20 | 19 | 18 | 17 | 16 | 15 | 31 | 30 | 29 | 28 | 27 | 26 | 25 | 24 | SDA | SCL | PWM | v1.0 | SARduino 644/1284 | by Andrew Schamp | Space Age Robotics | CC-BY-SA 13-04-2011 | Int2 | PWM | PWM | MOSI | MISO | SCK | 8 | 9 | Int0 | Int1 | PWM | PWM | PWM | RX2 | 11 | TX2 | 0 | 1 | 2 | 3 | 4 | 5 | 6 | 7 | Reset | VCC | GND | X2 | X1 | Rx | Tx | 10 | 12 | 13 | 14